# Altium schematic sheet eBox_Peripherals.SchDoc: eBox_Peripherals
size A4; DocumentNumber: 4; SheetNumber: 4; SheetTotal: 9
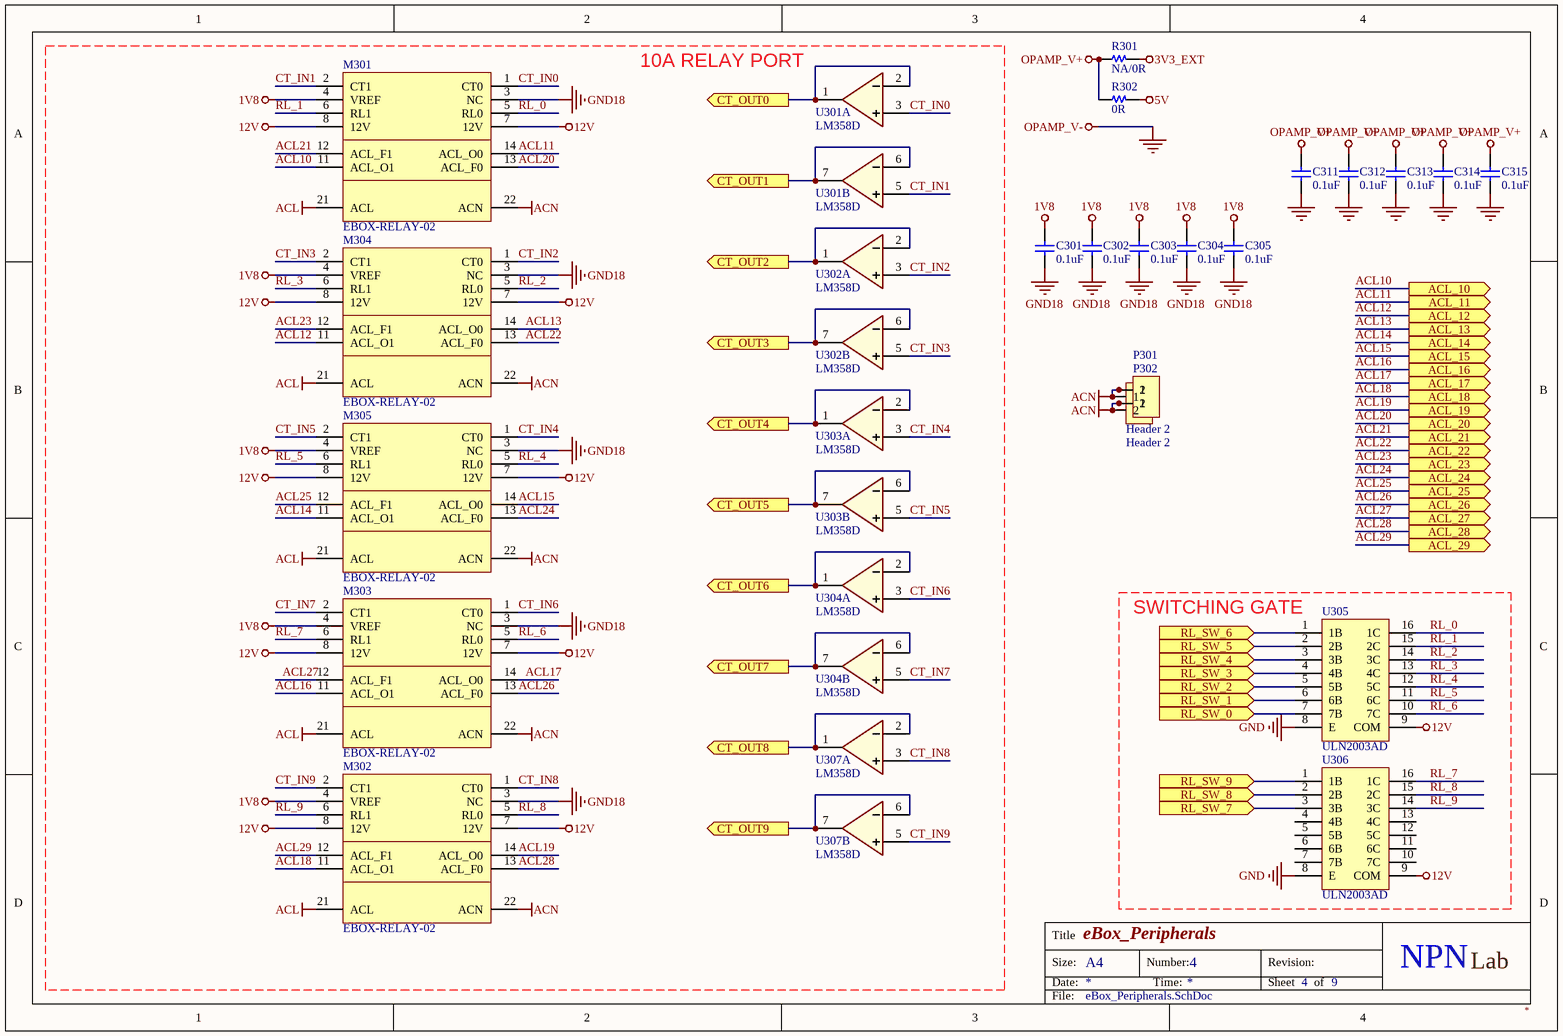
[diagram p0: eBox_Peripherals.SchDoc]

## Parts
C301  0.1uF  [C 0805]
C302  0.1uF  [C 0805]
C303  0.1uF  [C 0805]
C304  0.1uF  [C 0805]
C305  0.1uF  [C 0805]
C311  0.1uF  [C 0805]
C312  0.1uF  [C 0805]
C313  0.1uF  [C 0805]
C314  0.1uF  [C 0805]
C315  0.1uF  [C 0805]
M301  EBOX-RELAY-02  [EBOX-RELAY-02-90]
M302  EBOX-RELAY-02  [EBOX-RELAY-02-90]
M303  EBOX-RELAY-02  [EBOX-RELAY-02-90]
M304  EBOX-RELAY-02  [EBOX-RELAY-02-90]
M305  EBOX-RELAY-02  [EBOX-RELAY-02-90]
P301  Header 2  [HDR/Terminal/2/KF1000]  (no BOM)
P302  Header 2  [HDR/Terminal/2/KF55C-10]
P303  Header 2  [HDR/Terminal/2/KF1000]  (value not drawn)  (no BOM)
R301  NA/0R  [R 0603]
R302  0R  [R 0603]
U301  LM358D  [SOIC-8]  (parts A,B of 2)
U302  LM358D  [SOIC-8]  (parts A,B of 2)
U303  LM358D  [SOIC-8]  (parts A,B of 2)
U304  LM358D  [SOIC-8]  (parts A,B of 2)
U305  ULN2003AD  [SOIC-16]
U306  ULN2003AD  [SOIC-16]
U307  LM358D  [SOIC-8]  (parts A,B of 2)

## Ports
ACL_10 (out), ACL_11 (out), ACL_12 (out), ACL_13 (out), ACL_14 (out), ACL_15 (out), ACL_16 (out), ACL_17 (out), ACL_18 (out), ACL_19 (out), ACL_20 (out), ACL_21 (out), ACL_22 (out), ACL_23 (out), ACL_24 (out), ACL_25 (out), ACL_26 (out), ACL_27 (out), ACL_28 (out), ACL_29 (out), CT_OUT0 (out), CT_OUT1 (out), CT_OUT2 (out), CT_OUT3 (out), CT_OUT4 (out), CT_OUT5 (out), CT_OUT6 (out), CT_OUT7 (out), CT_OUT8 (out), CT_OUT9 (out), RL_SW_0 (in), RL_SW_1 (in), RL_SW_2 (in), RL_SW_3 (in), RL_SW_4 (in), RL_SW_5 (in), RL_SW_6 (in), RL_SW_7 (in), RL_SW_8 (in), RL_SW_9 (in)

## Nets
1V8: C301.1 C302.1 C303.1 C304.1 C305.1 M301.4(VREF) M302.4(VREF) M303.4(VREF) M304.4(VREF) M305.4(VREF)
3V3_EXT: R301.2
5V: R302.2
12V: M301.7(12V) M301.8(12V) M302.7(12V) M302.8(12V) M303.7(12V) M303.8(12V) M304.7(12V) M304.8(12V) M305.7(12V) M305.8(12V) U305.9(COM) U306.9(COM)
ACL: M301.21(ACL) M302.21(ACL) M303.21(ACL) M304.21(ACL) M305.21(ACL)
ACN: M301.22(ACN) M302.22(ACN) M303.22(ACN) M304.22(ACN) M305.22(ACN) P301.1 P301.2 P302.1 P302.2 P303.1 P303.2
GND: C311.2 C312.2 C313.2 C314.2 C315.2 U301.4(GND) U302.4(GND) U303.4(GND) U304.4(GND) U305.8(E) U306.8(E) U307.4(GND)  [also labelled OPAMP_V-]
GND18: C301.2 C302.2 C303.2 C304.2 C305.2 M301.3(NC) M302.3(NC) M303.3(NC) M304.3(NC) M305.3(NC)
OPAMP_V+: C311.1 C312.1 C313.1 C314.1 C315.1 R301.1 R302.1 U301.8(VCC) U302.8(VCC) U303.8(VCC) U304.8(VCC) U307.8(VCC)
ACL10: M301.11(ACL_O1) ; port ACL_10
ACL11: M301.14(ACL_O0) ; port ACL_11
ACL12: M304.11(ACL_O1) ; port ACL_12
ACL13: M304.14(ACL_O0) ; port ACL_13
ACL14: M305.11(ACL_O1) ; port ACL_14
ACL15: M305.14(ACL_O0) ; port ACL_15
ACL16: M303.11(ACL_O1) ; port ACL_16
ACL17: M303.14(ACL_O0) ; port ACL_17
ACL18: M302.11(ACL_O1) ; port ACL_18
ACL19: M302.14(ACL_O0) ; port ACL_19
ACL20: M301.13(ACL_F0) ; port ACL_20
ACL21: M301.12(ACL_F1) ; port ACL_21
ACL22: M304.13(ACL_F0) ; port ACL_22
ACL23: M304.12(ACL_F1) ; port ACL_23
ACL24: M305.13(ACL_F0) ; port ACL_24
ACL25: M305.12(ACL_F1) ; port ACL_25
ACL26: M303.13(ACL_F0) ; port ACL_26
ACL27: M303.12(ACL_F1) ; port ACL_27
ACL28: M302.13(ACL_F0) ; port ACL_28
ACL29: M302.12(ACL_F1) ; port ACL_29
CT_IN0: M301.1(CT0) U301.3(A+)
CT_IN1: M301.2(CT1) U301.5(B+)
CT_IN2: M304.1(CT0) U302.3(A+)
CT_IN3: M304.2(CT1) U302.5(B+)
CT_IN4: M305.1(CT0) U303.3(A+)
CT_IN5: M305.2(CT1) U303.5(B+)
CT_IN6: M303.1(CT0) U304.3(A+)
CT_IN7: M303.2(CT1) U304.5(B+)
CT_IN8: M302.1(CT0) U307.3(A+)
CT_IN9: M302.2(CT1) U307.5(B+)
CT_OUT0: U301.1(OutA) U301.2(A-) ; port CT_OUT0
CT_OUT1: U301.6(B-) U301.7(OutB) ; port CT_OUT1
CT_OUT2: U302.1(OutA) U302.2(A-) ; port CT_OUT2
CT_OUT3: U302.6(B-) U302.7(OutB) ; port CT_OUT3
CT_OUT4: U303.1(OutA) U303.2(A-) ; port CT_OUT4
CT_OUT5: U303.6(B-) U303.7(OutB) ; port CT_OUT5
CT_OUT6: U304.1(OutA) U304.2(A-) ; port CT_OUT6
CT_OUT7: U304.6(B-) U304.7(OutB) ; port CT_OUT7
CT_OUT8: U307.1(OutA) U307.2(A-) ; port CT_OUT8
CT_OUT9: U307.6(B-) U307.7(OutB) ; port CT_OUT9
RL_0: M301.5(RL0) U305.16(1C)
RL_1: M301.6(RL1) U305.15(2C)
RL_2: M304.5(RL0) U305.14(3C)
RL_3: M304.6(RL1) U305.13(4C)
RL_4: M305.5(RL0) U305.12(5C)
RL_5: M305.6(RL1) U305.11(6C)
RL_6: M303.5(RL0) U305.10(7C)
RL_7: M303.6(RL1) U306.16(1C)
RL_8: M302.5(RL0) U306.15(2C)
RL_9: M302.6(RL1) U306.14(3C)
RL_SW_0: U305.7(7B) ; port RL_SW_0
RL_SW_1: U305.6(6B) ; port RL_SW_1
RL_SW_2: U305.5(5B) ; port RL_SW_2
RL_SW_3: U305.4(4B) ; port RL_SW_3
RL_SW_4: U305.3(3B) ; port RL_SW_4
RL_SW_5: U305.2(2B) ; port RL_SW_5
RL_SW_6: U305.1(1B) ; port RL_SW_6
RL_SW_7: U306.3(3B) ; port RL_SW_7
RL_SW_8: U306.2(2B) ; port RL_SW_8
RL_SW_9: U306.1(1B) ; port RL_SW_9

Not connected (* = marked no-connect by the designer): U306 4(4B) 5(5B) 6(6B) 7(7B) 10(7C) 11(6C) 12(5C) 13(4C)

## Notes on the sheet
- 10A RELAY PORT
- SWITCHING GATE
- Title
- Size:
- Date:
- A4
- Number:
- Time:
- Revision:
- Sheet
- of
- NPN
- Lab
- File:

## Library data of the parts
C301-C305 C311-C315 = Capacitor NP: CAP CER 0.1UF 50V X7R 0805; TYPE: SMD; PACKAGE: SMD0805; STOCK CODE: CL21B104KBNC; SUPPLIER: tme.vn; STOCK DESC: 100nF/50V ±10% X7R SMD-0805 Capacitor; UNIT PRICE: 400
P301-P303 = Header 2: Header, 2-Pin
  P301 P303: TYPE: NO-BOM
  P302: TYPE: TH
R301 = Resistor: RES SMD 0 OHM 1% 1/10W 0603; PACKAGE: SMD0603; TYPE: SMD
R302 = Resistor: RES SMD 0 OHM 5% 1/10W 0603; PACKAGE: SMD0603; STOCK CODE: RM06JTN0; SUPPLIER: tme.vn; TYPE: SMD; STOCK DESC: 0R ±5% SMD-0603 Resistor; UNIT PRICE: 50
U301-U304 U307 = LM358: Low Power Dual Operational Amplifiers; PART NO: LM358DR; BRAND: TI; PACKAGE: SOIC-8; STOCK CODE: 296-1014-1-ND; SUPPLIER: Digi-Key; TYPE: SMD; STOCK DESC: IC OPAMP GP 2 CIRCUIT 8SOIC; UNIT PRICE: 8375
U305 U306 = ULN2003: IC PWR RELAY 7NPN 1:1 16SOIC; BRAND: Texas Instruments; PACKAGE: SOIC-16; PART NO: ULN2003AD; STOCK CODE: ULN2003AD; SUPPLIER: tme.vn; TYPE: SMD; STOCK DESC: TRANS 7 NPN DARL 50V 500MA 16SO; UNIT PRICE: 5000
M301-M305 = EBOX-RELAY-02: PART NO: EBOX-RELAY-02; STOCK CODE: EBOX-RELAY-02; TYPE: TH